# Altium schematic sheet [7]-RK3399 SDRAM Page.SchDoc
size A3; Organization: Altium Limited; Address1: L3, 12a Rodborough Rd; Address2: Frenchs Forest; Address3: NSW; Address4: Australia 2086
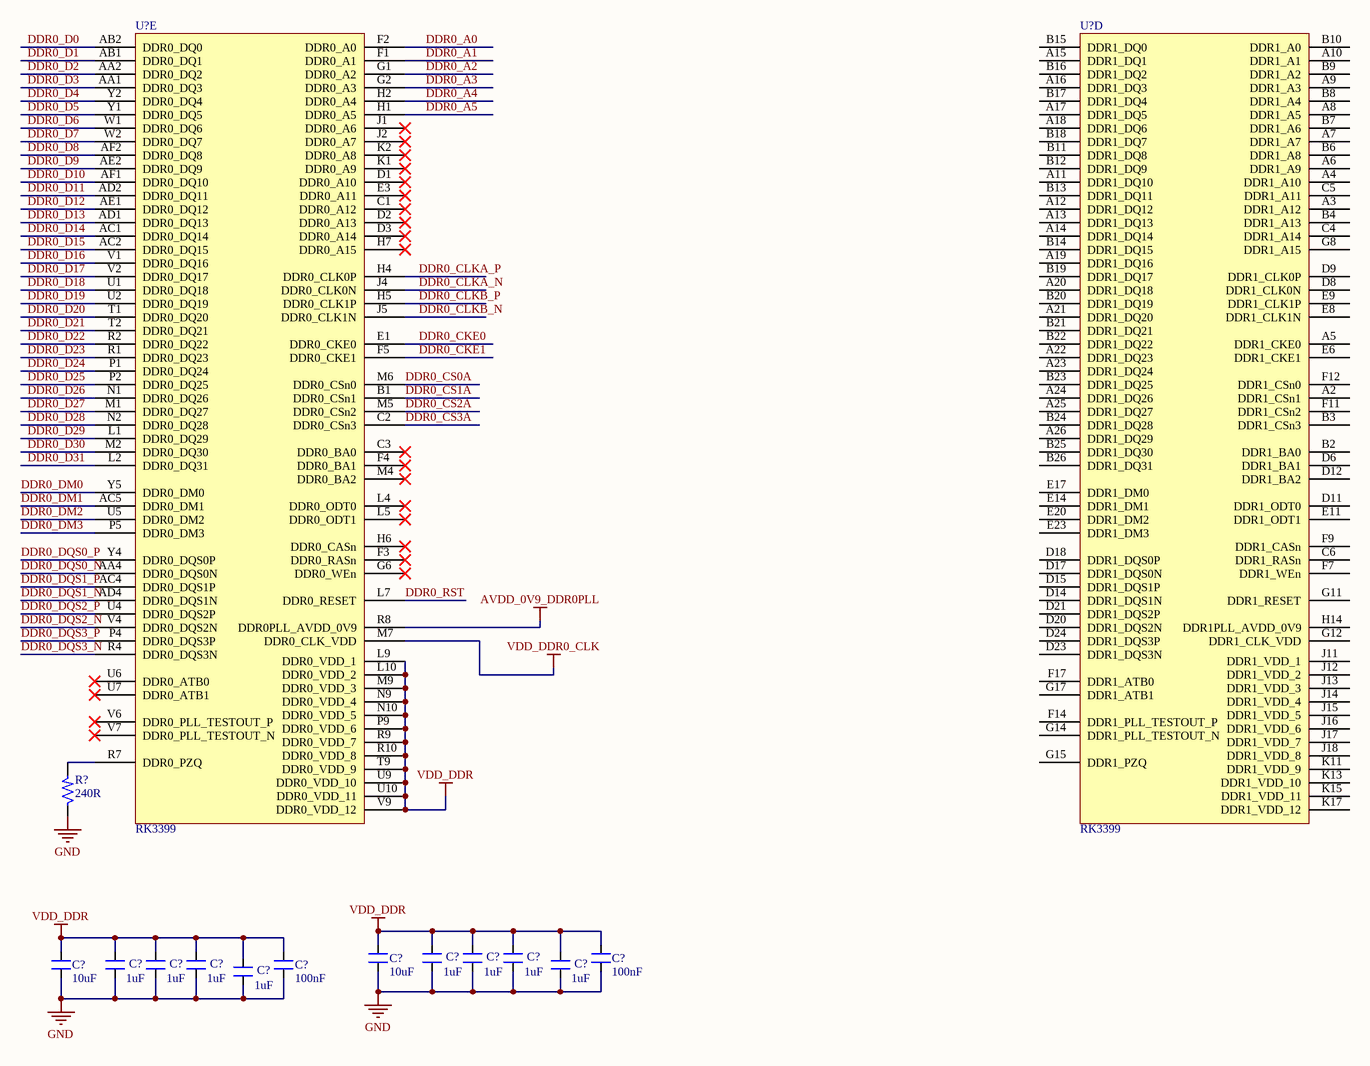
[diagram p0: [7]-RK3399 SDRAM Page.SchDoc]

## Parts
(Parts that share a designator on the sheet are numbered #1, #2 ... from top to bottom, then left to right.)
C?#1  10uF  [CAP_0603]
C?#2  1uF  [CAP_0402]
C?#3  1uF  [CAP_0402]
C?#4  1uF  [CAP_0402]
C?#5  100nF  [CAP_0201]
C?#6  10uF  [CAP_0603]
C?#7  1uF  [CAP_0402]
C?#8  1uF  [CAP_0402]
C?#9  1uF  [CAP_0402]
C?#10  100nF  [CAP_0201]
C?#11  1uF  [CAP_0402]
C?#12  1uF  [CAP_0402]
R?  240R  [RES_0201]
U?#1  RK3399  [FBGA828_23_826X826]  (part E of 24)
U?#2  RK3399  [FBGA828_23_826X826]  (part D of 24)

## Nets
AVDD_0V9_DDR0PLL: U?#1.R8(DDR0PLL_AVDD_0V9)
GND: C?#1.1 C?#2.1 C?#3.1 C?#4.1 C?#5.1 C?#6.1 C?#7.1 C?#8.1 C?#9.1 C?#10.1 C?#11.1 C?#12.1 R?.1
VDD_DDR: C?#1.2 C?#2.2 C?#3.2 C?#4.2 C?#5.2 C?#6.2 C?#7.2 C?#8.2 C?#9.2 C?#10.2 C?#11.2 C?#12.2 U?#1.L9(DDR0_VDD_1) U?#1.L10(DDR0_VDD_2) U?#1.M9(DDR0_VDD_3) U?#1.N9(DDR0_VDD_4) U?#1.N10(DDR0_VDD_5) U?#1.P9(DDR0_VDD_6) U?#1.R9(DDR0_VDD_7) U?#1.R10(DDR0_VDD_8) U?#1.T9(DDR0_VDD_9) U?#1.U9(DDR0_VDD_10) U?#1.U10(DDR0_VDD_11) U?#1.V9(DDR0_VDD_12)
VDD_DDR0_CLK: U?#1.M7(DDR0_CLK_VDD)
DDR0_A0: U?#1.F2(DDR0_A0)
DDR0_A1: U?#1.F1(DDR0_A1)
DDR0_A2: U?#1.G1(DDR0_A2)
DDR0_A3: U?#1.G2(DDR0_A3)
DDR0_A4: U?#1.H2(DDR0_A4)
DDR0_A5: U?#1.H1(DDR0_A5)
DDR0_CKE0: U?#1.E1(DDR0_CKE0)
DDR0_CKE1: U?#1.F5(DDR0_CKE1)
DDR0_CLKA_N: U?#1.J4(DDR0_CLK0N)
DDR0_CLKA_P: U?#1.H4(DDR0_CLK0P)
DDR0_CLKB_N: U?#1.J5(DDR0_CLK1N)
DDR0_CLKB_P: U?#1.H5(DDR0_CLK1P)
DDR0_CS0A: U?#1.M6(DDR0_CSn0)
DDR0_CS1A: U?#1.B1(DDR0_CSn1)
DDR0_CS2A: U?#1.M5(DDR0_CSn2)
DDR0_CS3A: U?#1.C2(DDR0_CSn3)
DDR0_D0: U?#1.AB2(DDR0_DQ0)
DDR0_D1: U?#1.AB1(DDR0_DQ1)
DDR0_D2: U?#1.AA2(DDR0_DQ2)
DDR0_D3: U?#1.AA1(DDR0_DQ3)
DDR0_D4: U?#1.Y2(DDR0_DQ4)
DDR0_D5: U?#1.Y1(DDR0_DQ5)
DDR0_D6: U?#1.W1(DDR0_DQ6)
DDR0_D7: U?#1.W2(DDR0_DQ7)
DDR0_D8: U?#1.AF2(DDR0_DQ8)
DDR0_D9: U?#1.AE2(DDR0_DQ9)
DDR0_D10: U?#1.AF1(DDR0_DQ10)
DDR0_D11: U?#1.AD2(DDR0_DQ11)
DDR0_D12: U?#1.AE1(DDR0_DQ12)
DDR0_D13: U?#1.AD1(DDR0_DQ13)
DDR0_D14: U?#1.AC1(DDR0_DQ14)
DDR0_D15: U?#1.AC2(DDR0_DQ15)
DDR0_D16: U?#1.V1(DDR0_DQ16)
DDR0_D17: U?#1.V2(DDR0_DQ17)
DDR0_D18: U?#1.U1(DDR0_DQ18)
DDR0_D19: U?#1.U2(DDR0_DQ19)
DDR0_D20: U?#1.T1(DDR0_DQ20)
DDR0_D21: U?#1.T2(DDR0_DQ21)
DDR0_D22: U?#1.R2(DDR0_DQ22)
DDR0_D23: U?#1.R1(DDR0_DQ23)
DDR0_D24: U?#1.P1(DDR0_DQ24)
DDR0_D25: U?#1.P2(DDR0_DQ25)
DDR0_D26: U?#1.N1(DDR0_DQ26)
DDR0_D27: U?#1.M1(DDR0_DQ27)
DDR0_D28: U?#1.N2(DDR0_DQ28)
DDR0_D29: U?#1.L1(DDR0_DQ29)
DDR0_D30: U?#1.M2(DDR0_DQ30)
DDR0_D31: U?#1.L2(DDR0_DQ31)
DDR0_DM0: U?#1.Y5(DDR0_DM0)
DDR0_DM1: U?#1.AC5(DDR0_DM1)
DDR0_DM2: U?#1.U5(DDR0_DM2)
DDR0_DM3: U?#1.P5(DDR0_DM3)
DDR0_DQS0_N: U?#1.AA4(DDR0_DQS0N)
DDR0_DQS0_P: U?#1.Y4(DDR0_DQS0P)
DDR0_DQS1_N: U?#1.AD4(DDR0_DQS1N)
DDR0_DQS1_P: U?#1.AC4(DDR0_DQS1P)
DDR0_DQS2_N: U?#1.V4(DDR0_DQS2N)
DDR0_DQS2_P: U?#1.U4(DDR0_DQS2P)
DDR0_DQS3_N: U?#1.R4(DDR0_DQS3N)
DDR0_DQS3_P: U?#1.P4(DDR0_DQS3P)
DDR0_RST: U?#1.L7(DDR0_RESET)
NetR?_2: R?.2 U?#1.R7(DDR0_PZQ)

Not connected (* = marked no-connect by the designer): U?#1 C1(DDR0_A12)* C3(DDR0_BA0)* D1(DDR0_A10)* D2(DDR0_A13)* D3(DDR0_A14)* E3(DDR0_A11)* F3(DDR0_RASn)* F4(DDR0_BA1)* G6(DDR0_WEn)* H6(DDR0_CASn)* H7(DDR0_A15)* J1(DDR0_A6)* J2(DDR0_A7)* K1(DDR0_A9)* K2(DDR0_A8)* L4(DDR0_ODT0)* L5(DDR0_ODT1)* M4(DDR0_BA2)* U6(DDR0_ATB0)* U7(DDR0_ATB1)* V6(DDR0_PLL_TESTOUT_P)* V7(DDR0_PLL_TESTOUT_N)*; U?#2 A2(DDR1_CSn1) A3(DDR1_A12) A4(DDR1_A10) A5(DDR1_CKE0) A6(DDR1_A9) A7(DDR1_A7) A8(DDR1_A5) A9(DDR1_A3) A10(DDR1_A1) A11(DDR1_DQ10) A12(DDR1_DQ12) A13(DDR1_DQ13) A14(DDR1_DQ14) A15(DDR1_DQ1) A16(DDR1_DQ3) A17(DDR1_DQ5) A18(DDR1_DQ6) A19(DDR1_DQ16) A20(DDR1_DQ18) A21(DDR1_DQ20) A22(DDR1_DQ23) A23(DDR1_DQ24) A24(DDR1_DQ26) A25(DDR1_DQ27) A26(DDR1_DQ29) B2(DDR1_BA0) B3(DDR1_CSn3) B4(DDR1_A13) B6(DDR1_A8) B7(DDR1_A6) B8(DDR1_A4) B9(DDR1_A2) B10(DDR1_A0) B11(DDR1_DQ8) B12(DDR1_DQ9) B13(DDR1_DQ11) B14(DDR1_DQ15) B15(DDR1_DQ0) B16(DDR1_DQ2) B17(DDR1_DQ4) B18(DDR1_DQ7) B19(DDR1_DQ17) B20(DDR1_DQ19) B21(DDR1_DQ21) B22(DDR1_DQ22) B23(DDR1_DQ25) B24(DDR1_DQ28) B25(DDR1_DQ30) B26(DDR1_DQ31) C4(DDR1_A14) C5(DDR1_A11) C6(DDR1_RASn) D6(DDR1_BA1) D8(DDR1_CLK0N) D9(DDR1_CLK0P) D11(DDR1_ODT0) D12(DDR1_BA2) D14(DDR1_DQS1N) D15(DDR1_DQS1P) D17(DDR1_DQS0N) D18(DDR1_DQS0P) D20(DDR1_DQS2N) D21(DDR1_DQS2P) D23(DDR1_DQS3N) D24(DDR1_DQS3P) E6(DDR1_CKE1) E8(DDR1_CLK1N) E9(DDR1_CLK1P) E11(DDR1_ODT1) E14(DDR1_DM1) E17(DDR1_DM0) E20(DDR1_DM2) E23(DDR1_DM3) F7(DDR1_WEn) F9(DDR1_CASn) F11(DDR1_CSn2) F12(DDR1_CSn0) F14(DDR1_PLL_TESTOUT_P) F17(DDR1_ATB0) G8(DDR1_A15) G11(DDR1_RESET) G12(DDR1_CLK_VDD) G14(DDR1_PLL_TESTOUT_N) G15(DDR1_PZQ) G17(DDR1_ATB1) H14(DDR1PLL_AVDD_0V9) J11(DDR1_VDD_1) J12(DDR1_VDD_2) J13(DDR1_VDD_3) J14(DDR1_VDD_4) J15(DDR1_VDD_5) J16(DDR1_VDD_6) J17(DDR1_VDD_7) J18(DDR1_VDD_8) K11(DDR1_VDD_9) K13(DDR1_VDD_10) K15(DDR1_VDD_11) K17(DDR1_VDD_12)

## Notes on the sheet
- Title
- Size:
- Date:
- A3
- Number:
- Time:
- Revision:
- Sheet
- of
- File:

## Library data of the parts
C?#1 C?#6 = CAP_10uF-10V-10%-0603: 10µF ±10% 10V Ceramic Capacitor X5R 0603 (1608 Metric) /; Manufacturer Part Number: GRM188R61A106KE69J; Manufacturer: Murata Electronics; Case/Package: 0603; Supplier-1: Digikey
C?#2-C?#4 C?#7-C?#9 C?#11 C?#12 = CAP_1uF-10V-10%-0402: 1µF ±10% 10V Ceramic Capacitor X6S 0402 (1005 Metric) /; Manufacturer: Murata Electronics; Manufacturer Part Number: GRT155C81A105KE01D; Case/Package: 0402; Supplier-1: Digikey
C?#5 C?#10 = CAP_100nF-25V-10%-0201: 0.1µF ±10% 25V Ceramic Capacitor X5R 0201 (0603 Metric) /; Manufacturer: TDK Corporation; Manufacturer Part Number: C0603X5R1E104K030BB; Case/Package: 0201; Supplier-1: Digikey
R? = RES_240R-0.05W-1%-0201: 240 Ohms ±1% 0.05W, 1/20W Chip Resistor 0201 (0603 Metric) Thick Film /; Manufacturer: Yageo; Manufacturer Part Number: RC0201FR-07240RL; Case/Package: 0201; Supplier-1: Digikey
U?#1 U?#2 = IC_RK3399-FCBGA828: RK3399 is a low power, high performance processor for computing, personal mobile.; Manufacturer: Rockchip; Manufacturer Part Number: RK3399; Case/Package: FCBGA828; Supplier-1: Rockchip